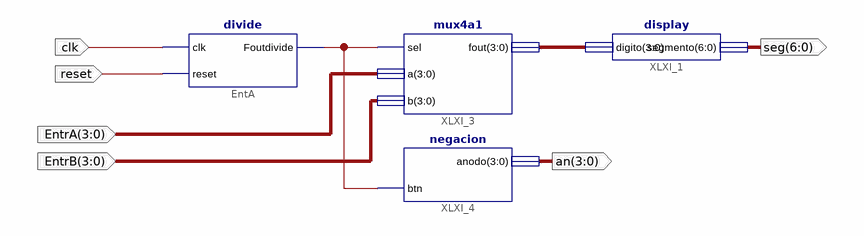
[diagram p0: schematic sheet 1]
// Xilinx ISE schematic SuperiorMuxDisplayAuto.sch (spartan6) as structural Verilog: 4 symbols, 6 ports
module SuperiorMuxDisplayAuto (
  input  reset,
  input  [3:0] EntrA,
  input  [3:0] EntrB,
  input  clk,
  output [6:0] seg,
  output [3:0] an
);

  wire XLXN_18;
  wire [3:0] XLXN_13;

  display XLXI_1 (.digito(XLXN_13), .segmento(seg));
  divide EntA (.clk(clk), .reset(reset), .Foutdivide(XLXN_18));
  mux4a1 XLXI_3 (.sel(XLXN_18), .a(EntrA), .b(EntrB), .fout(XLXN_13));
  negacion XLXI_4 (.btn(XLXN_18), .anodo(an));
endmodule
